# EasyEDA schematic easyedadiagrama.json
TITLE: Extrusora de filamento PET reciclado; REV: 1.0; Date: 2025-11-05; Sheet: 1/1; Drawn By: yerling Sandino; Company: Bamboo Plast
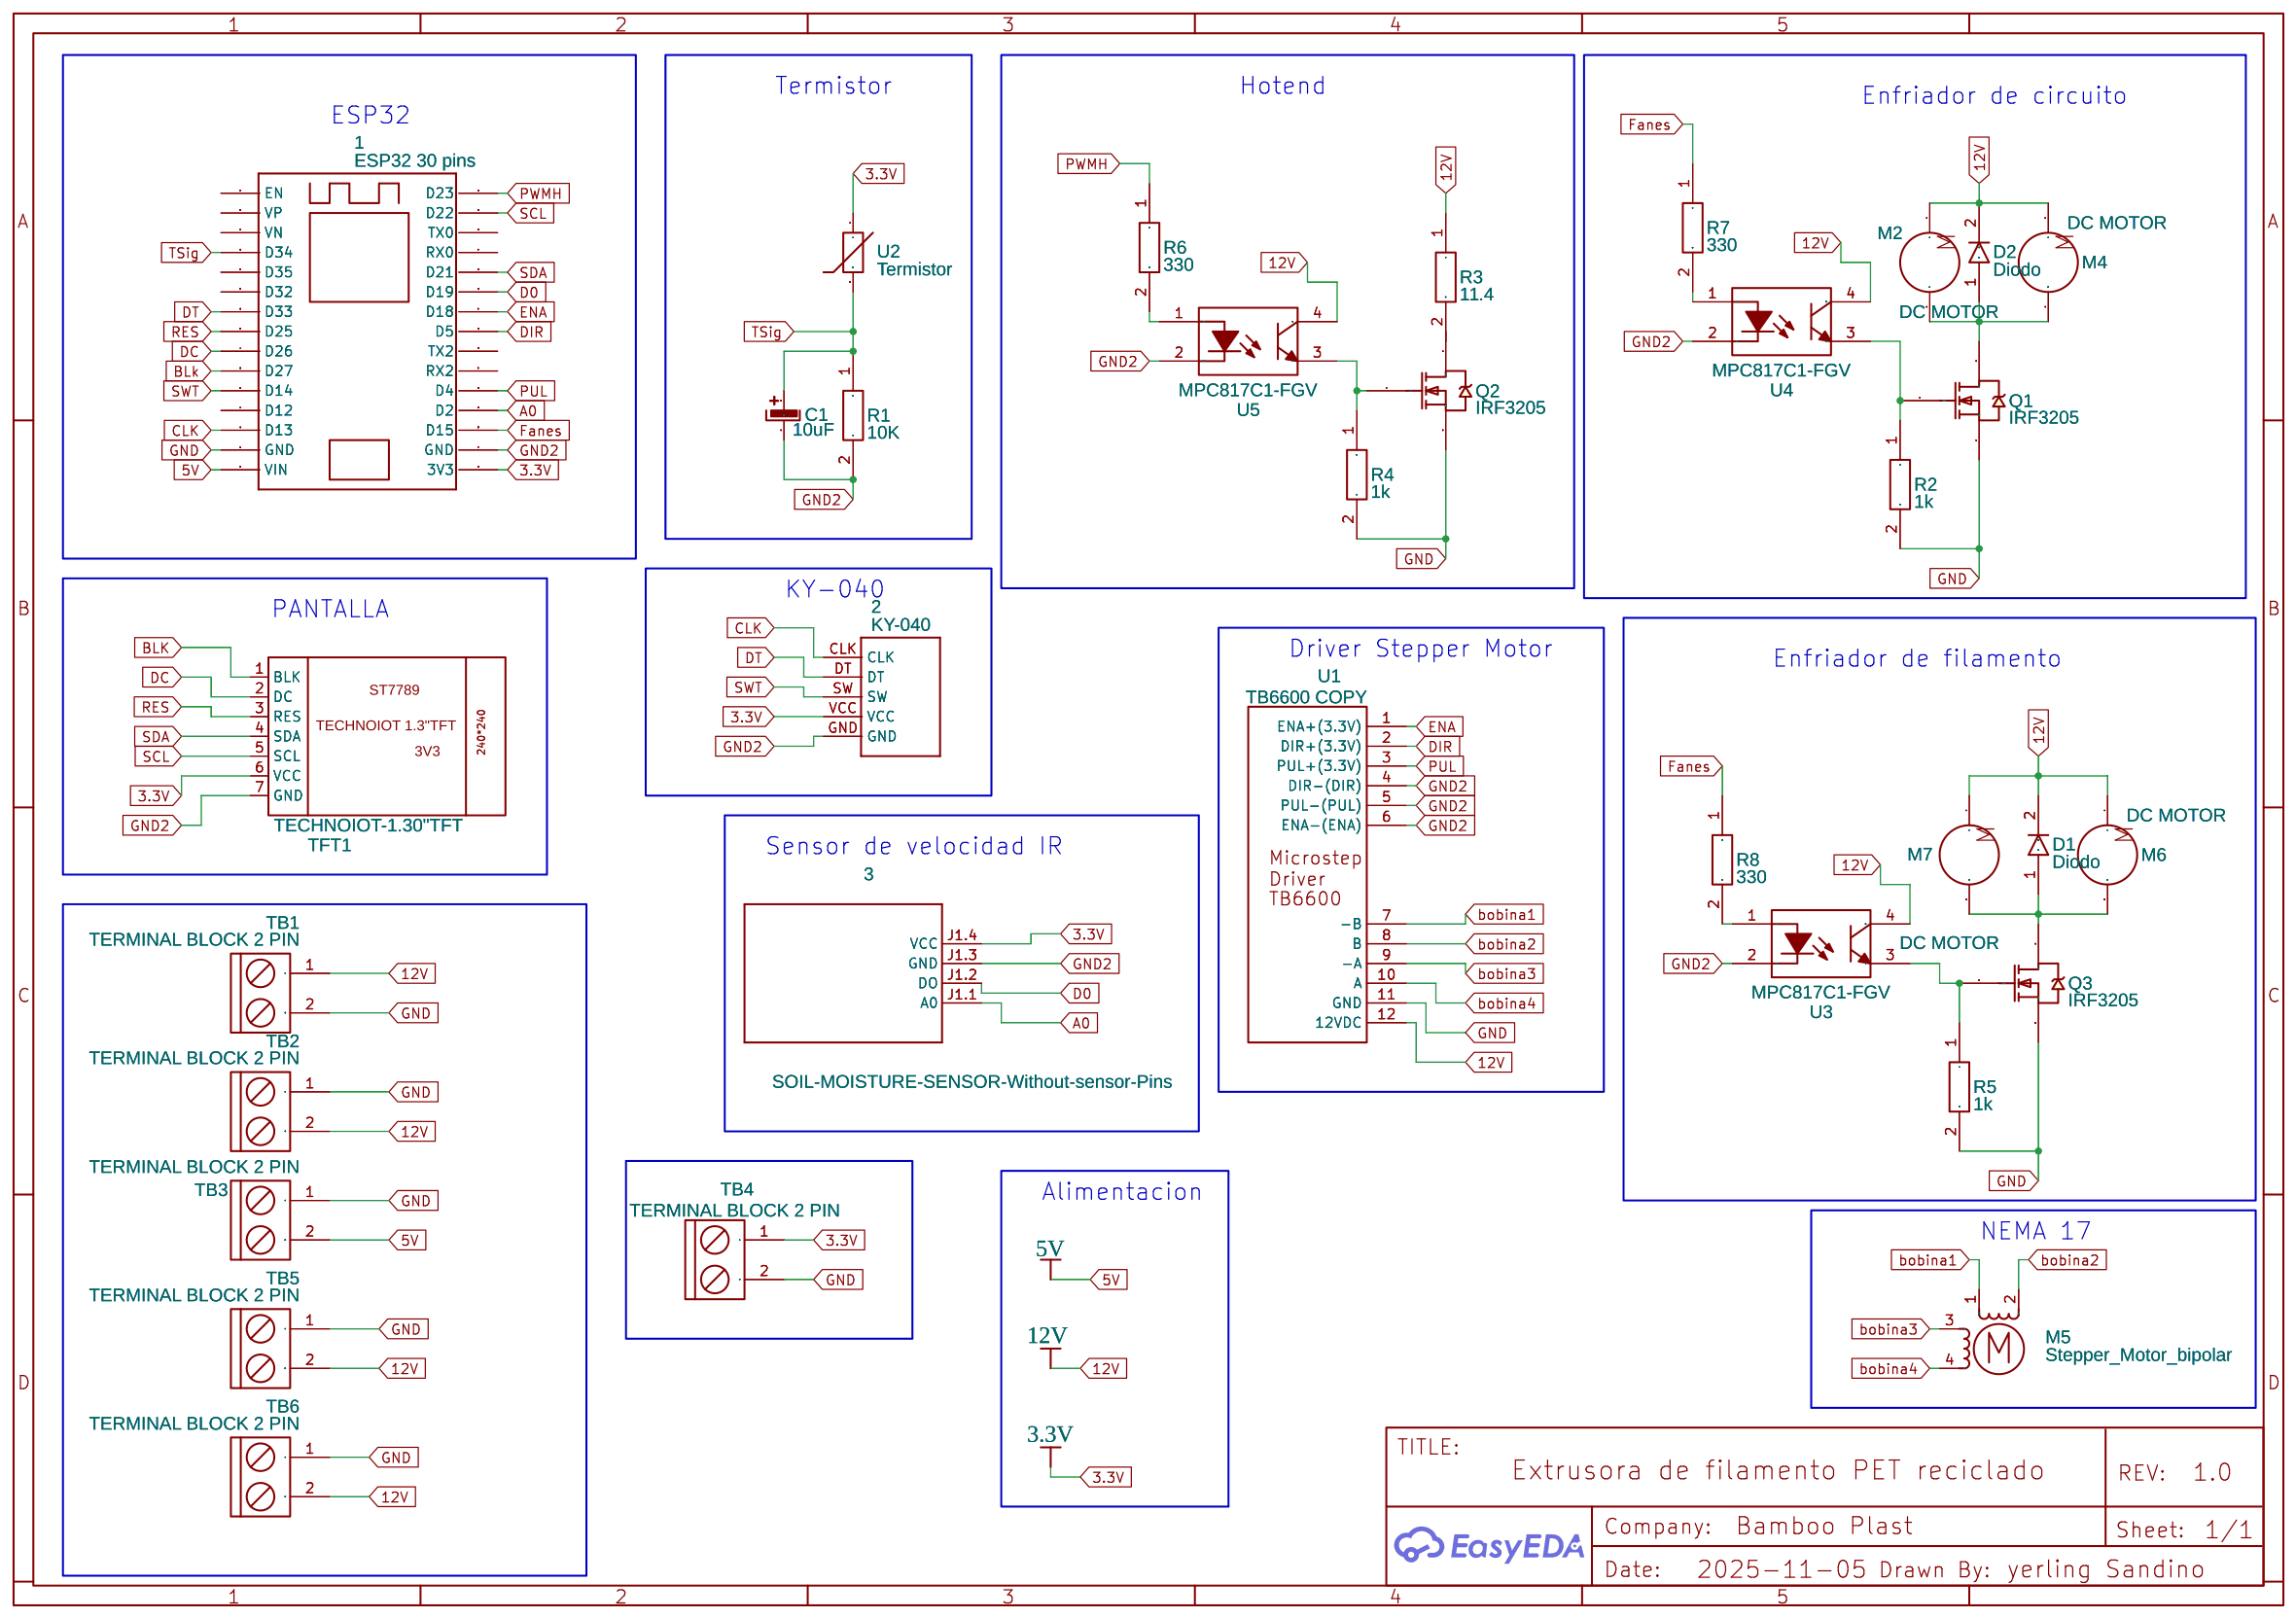
[diagram p0: schematic sheet]

## Parts
1  ESP32 30 pins  [ESP32 DEVKIT 30 PINS]
2  KY-040  [KY-040-PORT]
3  SOIL-MOISTURE-SENSOR-Without-sensor-Pins  [SOIL-MOISTURE-SENSOR-WITHOUT-SENSOR-PINS]
C1  10uF  [CONDENSADOR_ELECTROLITICO_02]
D1  Diodo  [DIODO]
D2  Diodo  [DIODO]
M2  DC MOTOR  [2 PIN TERMINAL BLOCK]
M4  DC MOTOR  [2 PIN TERMINAL BLOCK]
M5  Stepper_Motor_bipolar  [CONN-TH_4P-P2.50_XH-4A]
M6  DC MOTOR  [2 PIN TERMINAL BLOCK]
M7  DC MOTOR  [2 PIN TERMINAL BLOCK]
Q1  IRF3205  [TO-220AB]
Q2  IRF3205  [TO-220AB]
Q3  IRF3205  [TO-220AB]
R1  10K  [RESISTENCIAS]
R2  1k  [RESISTENCIAS]
R3  11.4  [RESISTENCIAS]
R4  1k  [RESISTENCIAS]
R5  1k  [RESISTENCIAS]
R6  330  [RESISTENCIAS]
R7  330  [RESISTENCIAS]
R8  330  [RESISTENCIAS]
TB1  TERMINAL BLOCK 2 PIN  [2 PIN TERMINAL BLOCK]
TB2  TERMINAL BLOCK 2 PIN  [2 PIN TERMINAL BLOCK]
TB3  TERMINAL BLOCK 2 PIN  [2 PIN TERMINAL BLOCK]
TB4  TERMINAL BLOCK 2 PIN  [2 PIN TERMINAL BLOCK]
TB5  TERMINAL BLOCK 2 PIN  [2 PIN TERMINAL BLOCK]
TB6  TERMINAL BLOCK 2 PIN  [2 PIN TERMINAL BLOCK]
TFT1  TECHNOIOT-1.30"TFT  [LCD-ST7789-1.3INCH1]
U1  TB6600 COPY  [TB6600]
U2  Termistor  [TERMISTOR]
U3  MPC817C1-FGV  [DIP-4_L6.5-W4.6-P2.54-LS7.6-BL]
U4  MPC817C1-FGV  [DIP-4_L6.5-W4.6-P2.54-LS7.6-BL]
U5  MPC817C1-FGV  [DIP-4_L6.5-W4.6-P2.54-LS7.6-BL]

## Library data of the parts
1 = ESP32 30 pins: Contributor: yerling.sandino
2 = KY-040: Contributor: hachstark
3 = SOIL-MOISTURE-SENSOR-Without-sensor-Pins: Contributor: nawara
C1 = CONDENSADOR: Supplier: EasyEDA; Contributor: mausko
D1 D2 = Diodo: Contributor: miriamfp22
M2 M4 M6 M7 = DC MOTOR: Contributor: yerling.sandino
M5 = Stepper_Motor_bipolar: Contributor: KiCAD; license: https://www.gnu.org/licenses/lgpl-2.1.html
Q1-Q3 = IRF3205: HEXFET Power MOSFET
R1-R8 = Resistencia: Contributor: joserod
TB1-TB6 = TERMINAL BLOCK 2 PIN: Manufacturer: On Shore Technology Inc.; Manufacturer Part: OSTTC020162; Supplier Part: ED2600-ND; Supplier: Digi-Key; Contributor: yerling.sandino; link: http://www.on-shore.com/wp-content/uploads/OSTTCXX0162.pdf
TFT1 = TECHNOIOT-1.30"TFT: Contributor: La Ode Muhamad Idris
U1 = TB6600 COPY: Supplier: EBay; link: https://www.ebay.com/itm/173654814212; Contributor: yerling.sandino
U2 = Termistor: Contributor: ankitotodouncapo
U3-U5 = MPC817C1-FGV: Supplier: LCSC; Supplier Part: C17701949; Manufacturer: MP(美禄科技); Contributor: lcsc

## Nets
3.3V: 1.16(3V3) 2.VCC 3.J1.4(VCC) TB4.1 TFT1.6(VCC) U2.1
5V: 1.1(VIN) TB3.2
12V: D1.2 D2.2 M2.1 M4.1 M6.1 M7.1 R3.1 TB1.1 TB2.2 TB5.2 TB6.2 U1.12(12VDC) U3.4(C) U4.4(C) U5.4(C)
GND: 1.2(GND) Q1.3(S) Q2.3(S) Q3.3(S) R2.2 R4.2 R5.2 TB1.2 TB2.1 TB3.1 TB4.2 TB5.1 TB6.1 U1.11(GND)
GND2: 1.17(GND) 2.GND 3.J1.3(GND) C1.2 R1.2 TFT1.7(GND) U1.4(DIR-(DIR)) U1.5(PUL-(PUL)) U1.6(ENA-(ENA)) U3.2(C) U4.2(C) U5.2(C)
A0: 1.19(D2) 3.J1.1(A0)
BLk: 1.6(D27)
BLK: TFT1.1(BLK)
bobina1: M5.1 U1.7(-B)
bobina2: M5.2 U1.8(B)
bobina3: M5.3 U1.9(-A)
bobina4: M5.4 U1.10(A)
CLK: 1.3(D13) 2.CLK
D0: 1.25(D19) 3.J1.2(DO)
DC: 1.7(D26) TFT1.2(DC)
DIR: 1.23(D5) U1.2(DIR+(3.3V))
DT: 1.9(D33) 2.DT
ENA: 1.24(D18) U1.1(ENA+(3.3V))
Fanes: 1.18(D15) R7.1 R8.1
PUL: 1.20(D4) U1.3(PUL+(3.3V))
PWMH: 1.30(D23) R6.1
RES: 1.8(D25) TFT1.3(RES)
SCL: 1.29(D22) TFT1.5(SCL)
SDA: 1.26(D21) TFT1.4(SDA)
SWT: 1.5(D14) 2.SW
TSig: 1.12(D34) C1.1 R1.1 U2.2
Net-(D1-1): D1.1 M6.2 M7.2 Q3.2(D)
Net-(D2-1): D2.1 M2.2 M4.2 Q1.2(D)
Net-(Q1-1): Q1.1(G) R2.1 U4.3(E)
Net-(Q2-1): Q2.1(G) R4.1 U5.3(E)
Net-(Q2-2): Q2.2(D) R3.2
Net-(Q3-1): Q3.1(G) R5.1 U3.3(E)
Net-(R6-2): R6.2 U5.1(A)
Net-(R7-2): R7.2 U4.1(A)
Net-(R8-2): R8.2 U3.1(A)

Not connected (* = marked no-connect by the designer): 1 4(D12) 10(D32) 11(D35) 13(VN) 14(VP) 15(EN) 21(RX2) 22(TX2) 27(RX0) 28(TX0)

## Notes on the sheet
- Termistor
- Hotend
- Enfriador de circuito
- ESP32
- KY-040
- PANTALLA
- Driver Stepper Motor
- Enfriador de filamento
- Sensor de velocidad IR
- Alimentacion
- NEMA 17
